# EAGLE design SCHEMATIC (EAGLE 9.6.2)
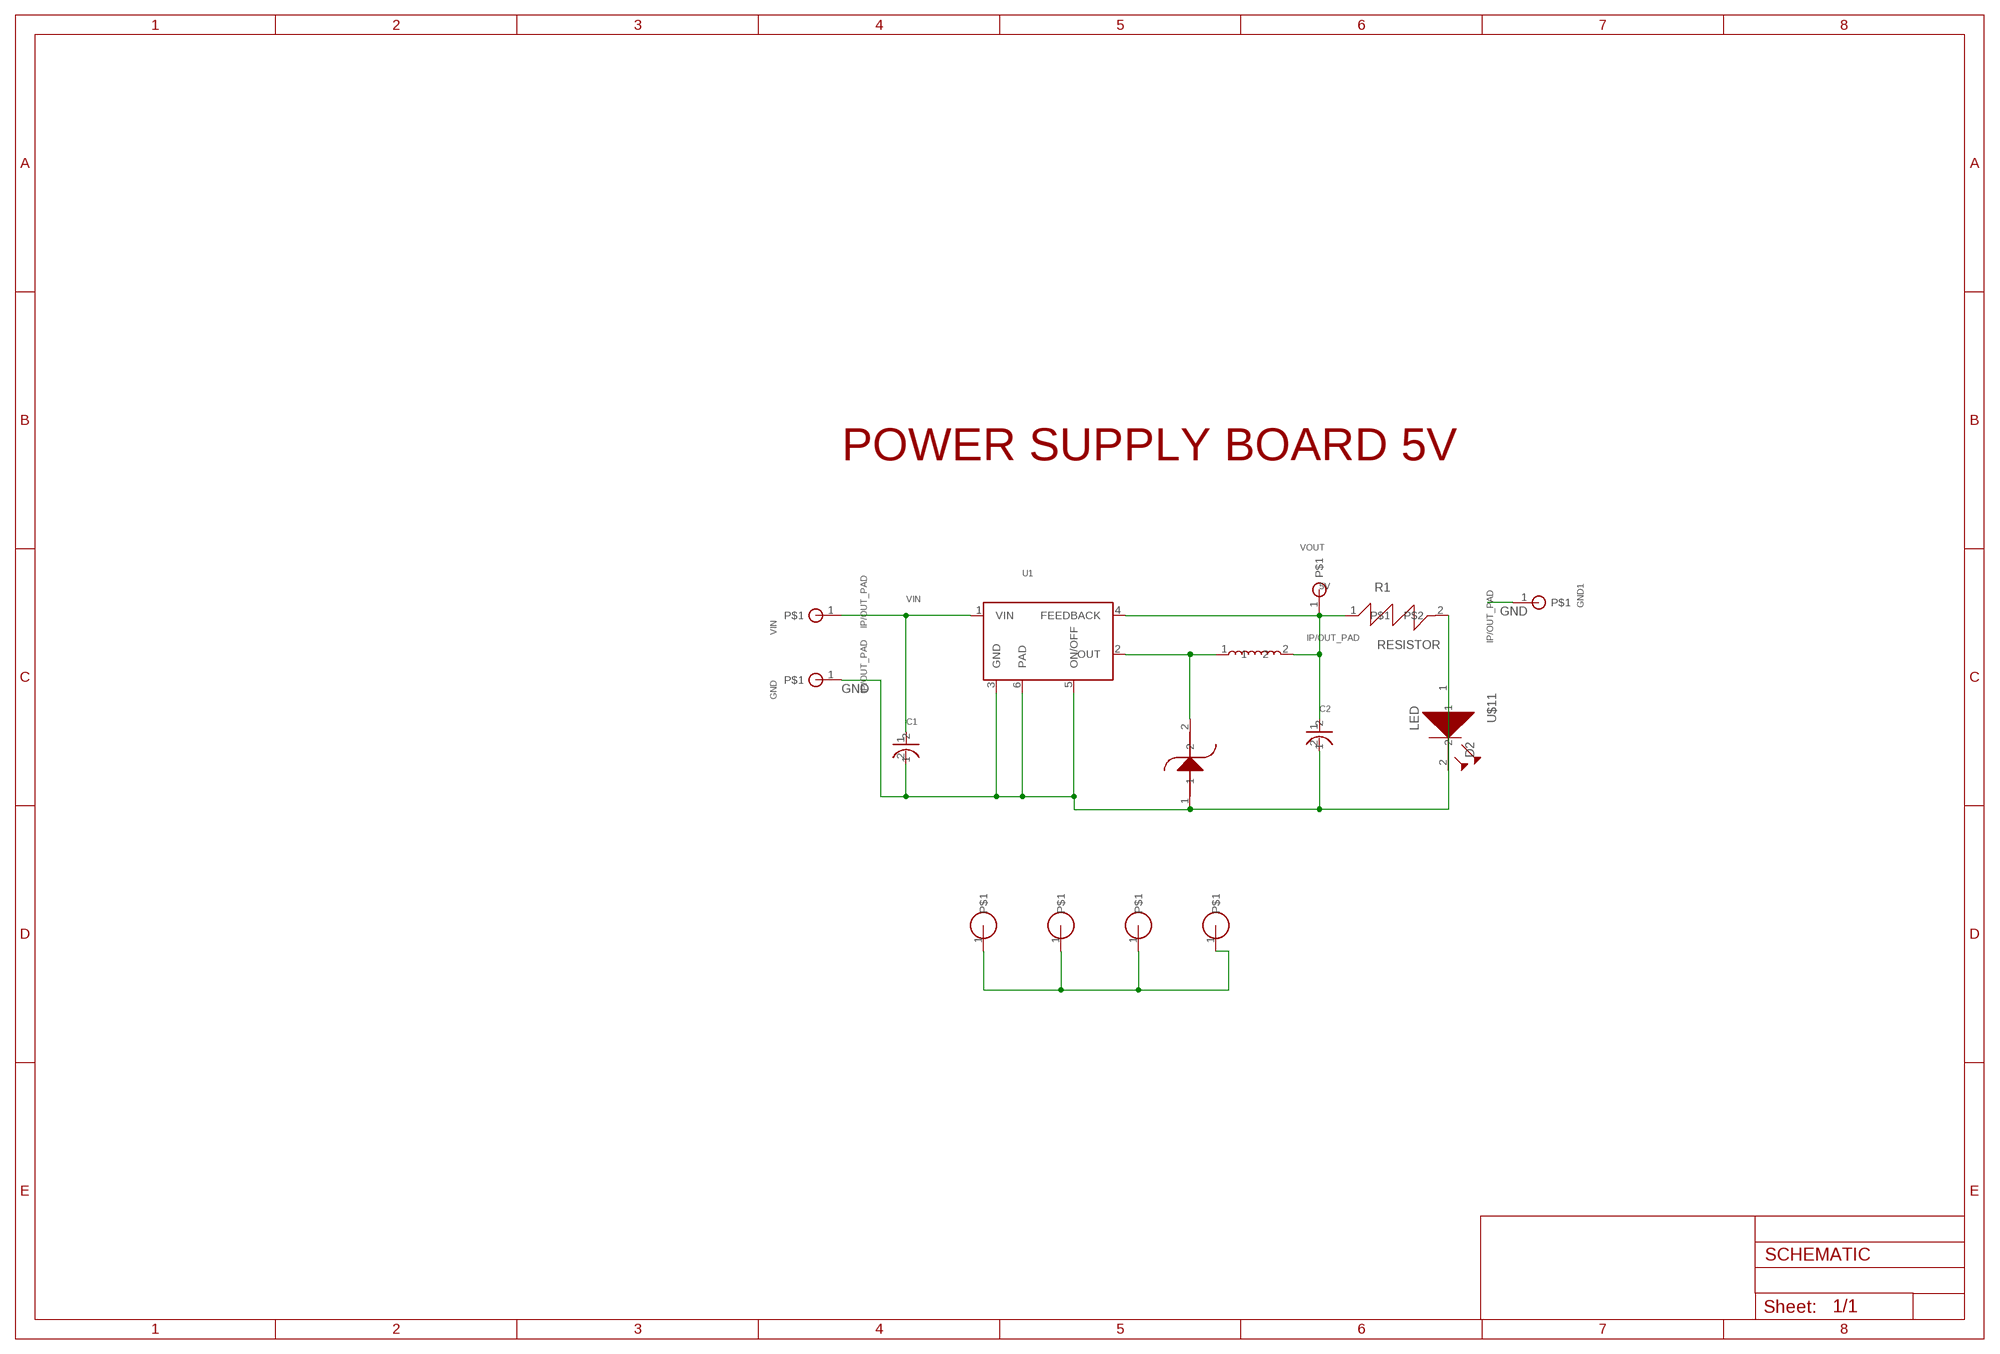
[diagram p0: schematic, sheet 1]

## Parts
C1  100uF  CAPACITOR  [CAPACITOR]
C2  1000uF  CAPACITOR  [CAPACITOR]
D1  1N5822  [1N5822_SMD]
GND  IP/OUT_PAD  [IP/OUT_PAD]
GND1  IP/OUT_PAD  [IP/OUT_PAD]
L1  100uH  INDUCTOR  [INDUCTOR]
MH1  MH_HOLE  [MH_HOLE]
MH2  MH_HOLE  [MH_HOLE]
MH3  MH_HOLE  [MH_HOLE]
MH4  MH_HOLE  [MH_HOLE]
R1  RESISTOR  [0805_RESISTOR]
U1  LM2576  [LM2576]
U$11  LED  [8085LED]
VIN  IP/OUT_PAD  [IP/OUT_PAD]
VOUT  IP/OUT_PAD  [IP/OUT_PAD]

## Nets
5V: C2.1 L1.2 R1.1 U1.4(FEEDBACK) VOUT.1
D2: R1.2 U$11.2
GND: C1.2 C2.2 D1.1 GND1.1 GND.1 U1.3(GND) U1.5(ON/OFF) U1.6(PAD) U$11.1
N$2: MH1.1 MH2.1 MH3.1 MH4.1
N$3: D1.2 L1.1 U1.2(OUT)
VIN: C1.1 U1.1(VIN) VIN.1

## Notes on the sheet
- POWER SUPPLY BOARD 5V

## Library data of the parts
C1 C2 = custom lib:CAPACITOR
D1 = custom lib:1N5822
GND GND1 VIN VOUT = custom lib:IP/OUT_PAD
L1 = custom lib:INDUCTOR
MH1-MH4 = custom lib:MH_HOLE
R1 = custom lib:RESISTOR
U1 = custom lib:LM2576
U$11 = custom lib:LED

## Board
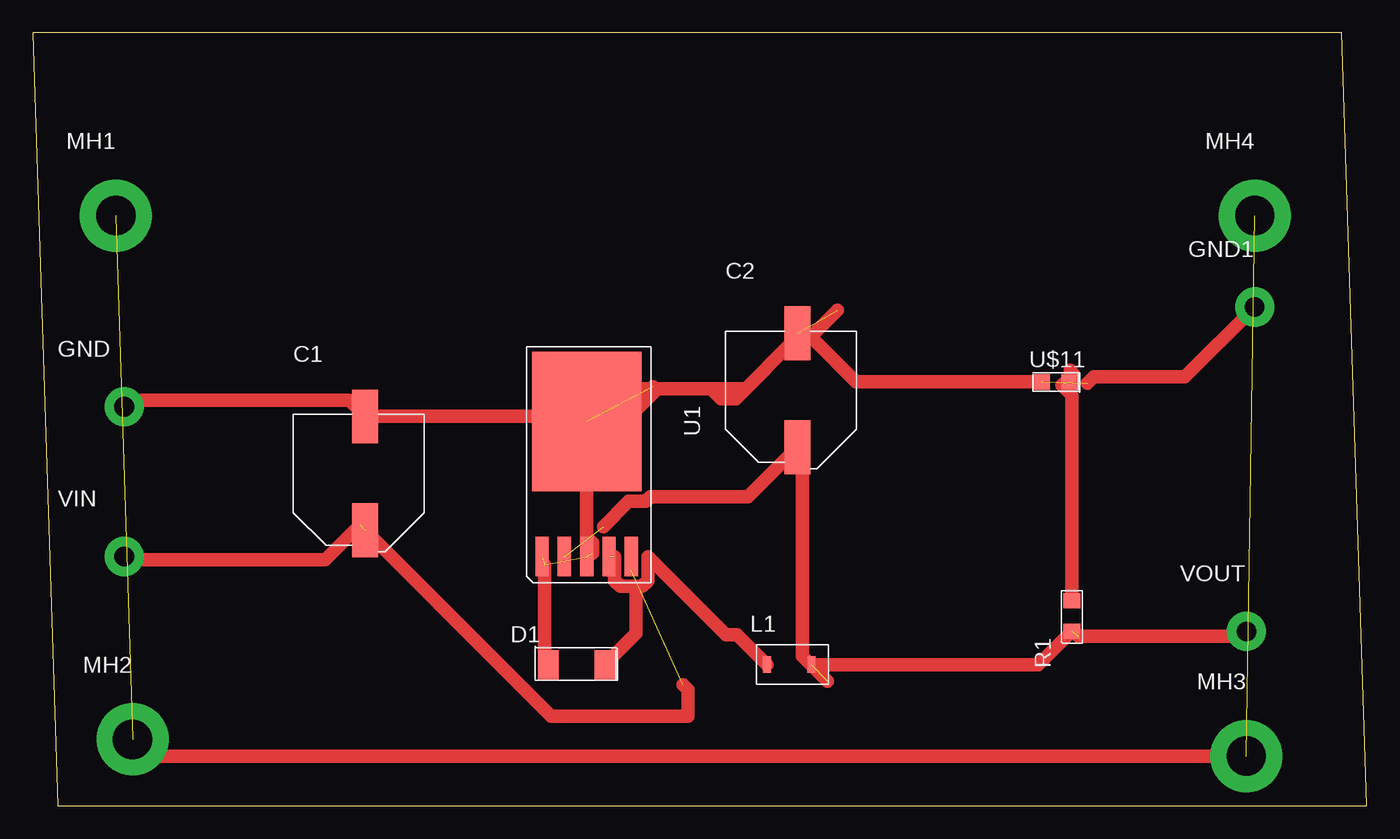
[diagram p1: board, top side]

Size 101.91 x 59.05 mm. Coordinates in mm from the lower left corner, seen from the top.
Outline: 1.91,0 101.91,0 100,59.05 0,59.05 1.91,0
Copper layers (1*16): Top 0.035mm / dielectric 1.5mm / Bottom 0.035mm
Design rules "default *": minimum track width 10mil, minimum drill 0.35mm, track to track 10mil, track to pad 10mil, pad to pad 10mil, via to via 10mil, smd to smd 6mil, copper to edge 40mil, drill to drill 6mil, minimum pad ring 10mil, minimum via ring 8mil, stop-mask expansion 4mil, vias tented up to drill 0mil, thermal gap 10mil

### Footprints (pad centres in the part's own frame; a part is rotated, then mirrored left to right if it is on the bottom)
CAPACITOR = smd 2 x 4.1: 1 0,-4.35; 2 0,4.35
1N5822_SMD = smd 1.57 x 2.22: 1 0,0; 2 4.32,0
IP/OUT_PAD = drill 1.5 pad 3: 1 0,0
INDUCTOR = smd 0.635 x 1.27: 1 -1.7,0; 2 1.7,0
MH_HOLE = drill 3 pad 5.5: 1 0,0
0805_RESISTOR = smd 1.15 x 1.3: 1 0,0; 2 2.35,0
LM2576 = smd 3.05 x 1.016: 1 0,0; 2 0,-1.702; 3 0,-3.404; 4 0,-5.106; 5 0,-6.808 | smd 10.66 x 8.38: 6 -10.302,-3.404
8085LED = smd 1.2 x 1.2: 1 0,0; 2 2.1,0

### Placement (x,y rotation side)
C1  25.4,25.4 0 top
C2  58.42,31.75 0 top
D1  39.37,10.79 0 top
GND  6.99,30.48 0 top
GND1  93.34,38.1 0 top
L1  57.79,10.79 0 top
MH1  6.35,45.09 0 top
MH2  7.62,5.08 0 top
MH3  92.71,3.81 0 top
MH4  93.34,45.09 0 top
R1  79.38,13.34 90 top
U1  45.72,19.05 270 top
U$11  77.09,32.38 0 top
VIN  6.99,19.05 0 top
VOUT  92.71,13.34 0 top

### Tracks (layer width: path | path; a pad name or v marks a point on that pad's centre or on a via)
5V  (3 unrouted)
  Top 1.016: L1.2 76.84,10.79 R1.1 | 60.71,9.53 58.8,11.43 58.8,27.02 C2.1 54.64,23.62 47.18,23.62 46.82,23.26 45.51,23.26 43.59,21.34 | VOUT.1 92.33,12.95 79.88,12.95
D2  (1 unrouted)
  Top 1.016: U$11.2 79.19,32.71 79.5,33.02 79.25,33.27 | R1.2 79.38,31.37 78.61,32.13 78.74,32.26
GND  (6 unrouted)
  Top 1.016: GND.1 6.99,29.84 6.86,29.72 6.16,30.42 6.73,30.99 24.16,30.99 C1.2 39.21,29.75 39.24,29.72 45.59,29.72 47.62,31.75 47.37,32 | U1.6 44.84,31.88 51.82,31.88 | 51.82,31.88 54.48,31.88 | C2.2 58.42,35.81 53.72,31.11 52.58,31.11 51.82,31.88 | U1.6 42.32,20.55 42.75,20.12 42.75,19.3 | U1.6 41.27,28.31 41.27,27.81 40.51,27.05 39.75,27.05 | D1.1 39.12,11.05 39.12,18.41 | U$11.1 62.87,32.38 59.44,35.81 61.47,37.85 | GND1.1 88.01,32.77 81.04,32.77 80.55,32.27
N$2  (2 unrouted)
  Top 1.016: MH3.1 8.89,3.81 MH2.1 | MH2.1 7.62,4.06 8,4.06 8,4.7 MH2.1
N$3  (1 unrouted)
  Top 1.016: D1.2 46.1,13.21 46.1,16.76 | 46.1,16.76 46.54,16.76 46.99,17.21 46.99,19.05 52.96,13.08 53.8,13.08 L1.1 | 46.1,16.76 44.9,16.76 44.45,17.21 44.45,19.05
VIN  (2 unrouted)
  Top 1.016: 6.35,18.41 VIN.1 7.24,19.05 7.49,18.8 22.35,18.8 25.02,21.46 | C1.1 39.59,6.86 50.04,6.86 50.04,8.89 49.66,9.27 | U1.1 45.72,18.03